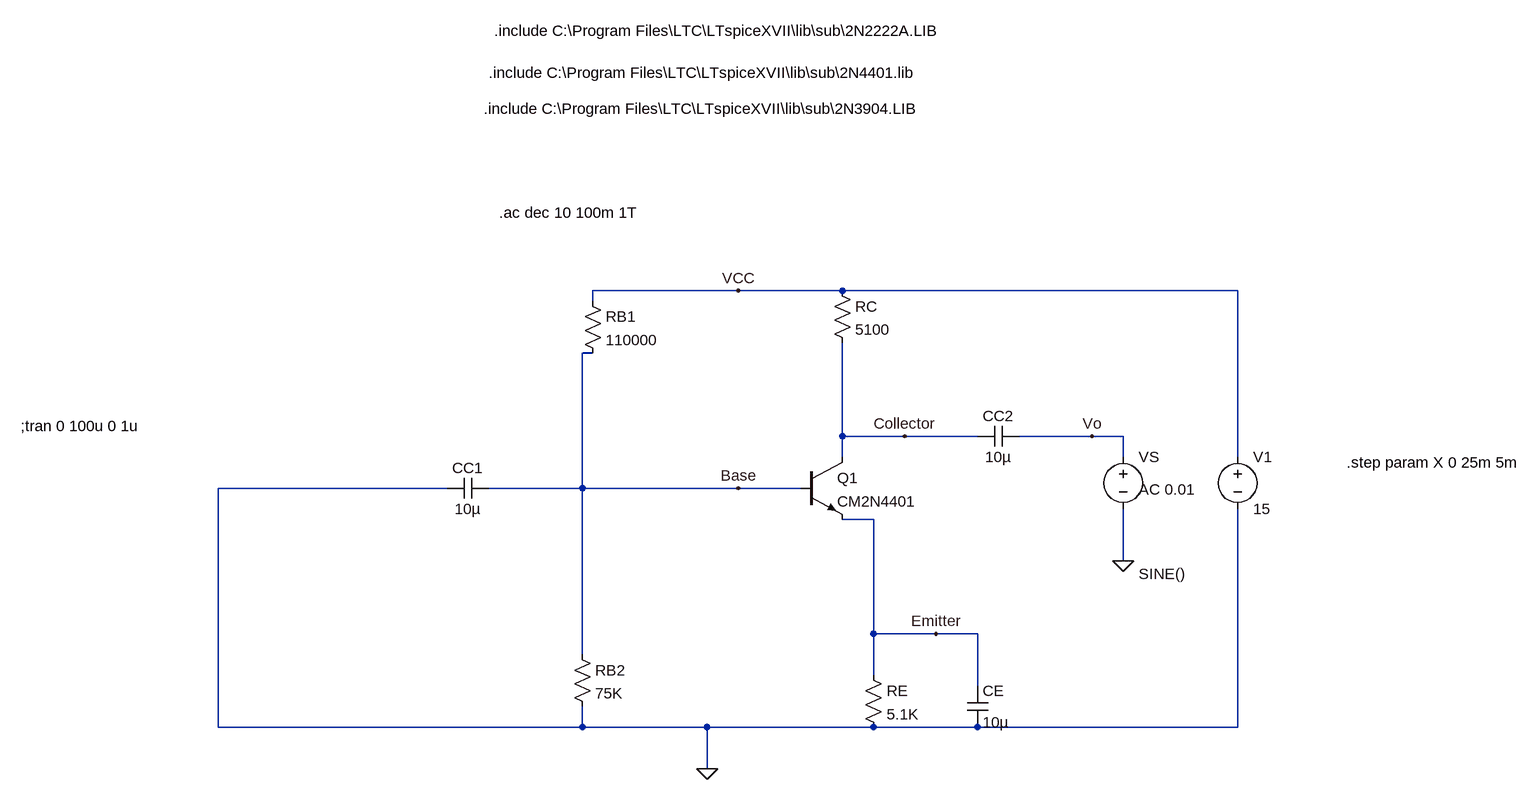
[diagram p0: schematic mp2 task2 d).asc]
mp2 task2 d).asc, the LTspice schematic file:
Version 4
SHEET 1 3216 804
WIRE 288 -16 64 -16
WIRE 448 -16 288 -16
WIRE 1056 -16 448 -16
WIRE 64 0 64 -16
WIRE 64 80 48 80
WIRE 448 208 448 64
WIRE 544 208 448 208
WIRE 656 208 544 208
WIRE 832 208 720 208
WIRE 880 208 832 208
WIRE 448 240 448 208
WIRE 880 240 880 208
WIRE 1056 240 1056 -16
WIRE -160 288 -512 288
WIRE 48 288 48 80
WIRE 48 288 -96 288
WIRE 288 288 48 288
WIRE 384 288 288 288
WIRE 496 336 448 336
WIRE 880 400 880 320
WIRE 496 512 496 336
WIRE 592 512 496 512
WIRE 656 512 592 512
WIRE 48 544 48 288
WIRE 496 576 496 512
WIRE 656 592 656 512
WIRE -512 656 -512 288
WIRE 48 656 48 624
WIRE 48 656 -512 656
WIRE 240 656 48 656
WIRE 496 656 240 656
WIRE 656 656 496 656
WIRE 1056 656 1056 320
WIRE 1056 656 656 656
WIRE 240 720 240 656
FLAG 240 720 0
FLAG 288 -16 VCC
FLAG 592 512 Emitter
FLAG 880 400 0
FLAG 544 208 Collector
FLAG 288 288 Base
FLAG 832 208 Vo
SYMBOL res 48 -16 R0
SYMATTR InstName RB1
SYMATTR Value 110000
SYMBOL res 432 -32 R0
SYMATTR InstName RC
SYMATTR Value 5100
SYMBOL res 32 528 R0
SYMATTR InstName RB2
SYMATTR Value 75K
SYMBOL npn 384 240 R0
SYMATTR InstName Q1
SYMATTR Value CM2N4401
SYMBOL res 480 560 R0
SYMATTR InstName RE
SYMATTR Value 5.1K
SYMBOL cap -96 272 R90
WINDOW 0 0 32 VBottom 2
WINDOW 3 32 32 VTop 2
SYMATTR InstName CC1
SYMATTR Value 10µ
SYMBOL cap 640 592 R0
SYMATTR InstName CE
SYMATTR Value 10µ
SYMBOL cap 720 192 R90
WINDOW 0 0 32 VBottom 2
WINDOW 3 32 32 VTop 2
SYMATTR InstName CC2
SYMATTR Value 10µ
SYMBOL voltage 880 224 R0
WINDOW 3 24 196 Left 2
WINDOW 123 24 66 Left 2
WINDOW 39 0 0 Left 0
SYMATTR Value SINE()
SYMATTR Value2 AC 0.01
SYMATTR InstName VS
SYMBOL voltage 1056 224 R0
WINDOW 123 0 0 Left 0
WINDOW 39 0 0 Left 0
SYMATTR InstName V1
SYMATTR Value 15
TEXT -104 -296 Left 2 !.include C:\\Program Files\\LTC\\LTspiceXVII\\lib\\sub\\2N3904.LIB
TEXT -96 -352 Left 2 !.include C:\\Program Files\\LTC\\LTspiceXVII\\lib\\sub\\2N4401.lib
TEXT -88 -416 Left 2 !.include C:\\Program Files\\LTC\\LTspiceXVII\\lib\\sub\\2N2222A.LIB
TEXT -80 -136 Left 2 !.ac dec 10 100m 1T
TEXT -816 192 Left 2 !;tran 0 100u 0 1u
TEXT 1224 248 Left 2 !.step param X 0 25m 5m

The netlist it stands for:
* mp2 task2 d).asc
RB1 VCC Base 110000
RC VCC Collector 5100
RB2 Base 0 75K
Q1 Collector Base Emitter 0 CM2N4401
RE Emitter 0 5.1K
CC1 Base 0 10µ
CE Emitter 0 10µ
CC2 Vo Collector 10µ
VS Vo 0 SINE() AC 0.01
V1 VCC 0 15
.model NPN NPN
.model PNP PNP
.lib standard.bjt
.include C:\Program Files\LTC\LTspiceXVII\lib\sub\2N3904.LIB
.include C:\Program Files\LTC\LTspiceXVII\lib\sub\2N4401.lib
.include C:\Program Files\LTC\LTspiceXVII\lib\sub\2N2222A.LIB
.ac dec 10 100m 1T
;tran 0 100u 0 1u
.step param X 0 25m 5m
.backanno
.end

* Results of the author's LTspice run, read from the files saved beside the schematic
* Operating Point (first step), zero values left out:
*   V(vcc) = 15 V
*   V(base) = 5.778 V
*   V(collector) = 9.915 V
*   V(emitter) = 5.12 V
*   Ic(Q1) = 997.1 µA
*   Ib(Q1) = 6.803 µA
*   Ie(Q1) = -1.004 mA
*   I(Re) = 1.004 mA
*   I(Rb2) = 77.04 µA
*   I(Rc) = 997.1 µA
*   I(Rb1) = 83.84 µA
*   I(V1) = -1.081 mA
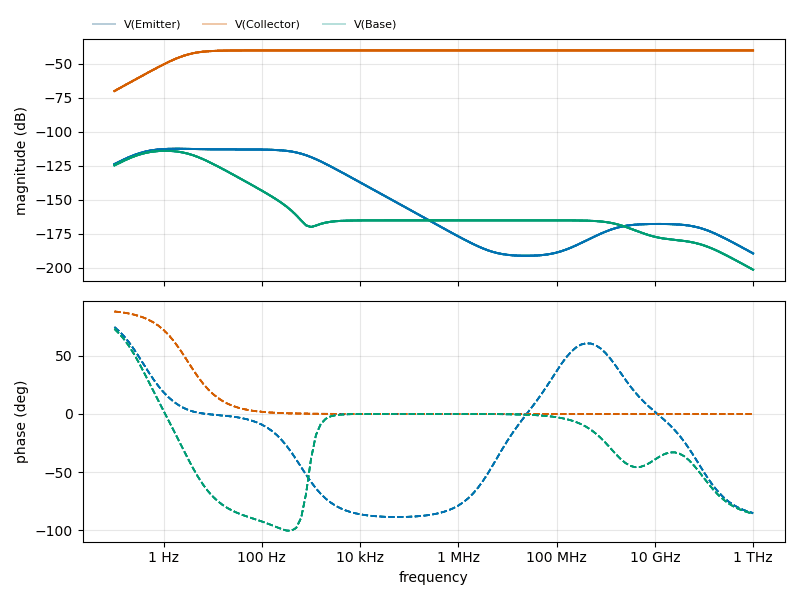
[diagram p1: AC Analysis of mp2 task2 d).asc, plotted from the saved traces]
* AC Analysis, 6 runs:
*   V(Emitter) [x=0]: -123.78 dB at 100 mHz, -189.58 dB at 1 THz, peak -112.46 dB at 1.995 Hz, 3 dB below the peak at 344.1 mHz and 538.7 Hz
*   V(Emitter) [x=0.005]: -123.78 dB at 100 mHz, -189.58 dB at 1 THz, peak -112.46 dB at 1.995 Hz, 3 dB below the peak at 344.1 mHz and 538.7 Hz
*   V(Emitter) [x=0.01]: -123.78 dB at 100 mHz, -189.58 dB at 1 THz, peak -112.46 dB at 1.995 Hz, 3 dB below the peak at 344.1 mHz and 538.7 Hz
*   V(Emitter) [x=0.015]: -123.78 dB at 100 mHz, -189.58 dB at 1 THz, peak -112.46 dB at 1.995 Hz, 3 dB below the peak at 344.1 mHz and 538.7 Hz
*   V(Emitter) [x=0.02]: -123.78 dB at 100 mHz, -189.58 dB at 1 THz, peak -112.46 dB at 1.995 Hz, 3 dB below the peak at 344.1 mHz and 538.7 Hz
*   V(Emitter) [x=0.025]: -123.78 dB at 100 mHz, -189.58 dB at 1 THz, peak -112.46 dB at 1.995 Hz, 3 dB below the peak at 344.1 mHz and 538.7 Hz
*   V(Collector) [x=0]: -69.91 dB at 100 mHz, -40.00 dB at 1 THz, peak -40.00 dB at 1 THz, 3 dB below the peak at 3.127 Hz
*   V(Collector) [x=0.005]: -69.91 dB at 100 mHz, -40.00 dB at 1 THz, peak -40.00 dB at 1 THz, 3 dB below the peak at 3.127 Hz
*   V(Collector) [x=0.01]: -69.91 dB at 100 mHz, -40.00 dB at 1 THz, peak -40.00 dB at 1 THz, 3 dB below the peak at 3.127 Hz
*   V(Collector) [x=0.015]: -69.91 dB at 100 mHz, -40.00 dB at 1 THz, peak -40.00 dB at 1 THz, 3 dB below the peak at 3.127 Hz
*   V(Collector) [x=0.02]: -69.91 dB at 100 mHz, -40.00 dB at 1 THz, peak -40.00 dB at 1 THz, 3 dB below the peak at 3.127 Hz
*   V(Collector) [x=0.025]: -69.91 dB at 100 mHz, -40.00 dB at 1 THz, peak -40.00 dB at 1 THz, 3 dB below the peak at 3.127 Hz
*   V(Base) [x=0]: -124.73 dB at 100 mHz, -201.58 dB at 1 THz, peak -114.00 dB at 1 Hz, 3 dB below the peak at 306 mHz and 3.791 Hz
*   V(Base) [x=0.005]: -124.73 dB at 100 mHz, -201.58 dB at 1 THz, peak -114.00 dB at 1 Hz, 3 dB below the peak at 306 mHz and 3.791 Hz
*   V(Base) [x=0.01]: -124.73 dB at 100 mHz, -201.58 dB at 1 THz, peak -114.00 dB at 1 Hz, 3 dB below the peak at 306 mHz and 3.791 Hz
*   V(Base) [x=0.015]: -124.73 dB at 100 mHz, -201.58 dB at 1 THz, peak -114.00 dB at 1 Hz, 3 dB below the peak at 306 mHz and 3.791 Hz
*   V(Base) [x=0.02]: -124.73 dB at 100 mHz, -201.58 dB at 1 THz, peak -114.00 dB at 1 Hz, 3 dB below the peak at 306 mHz and 3.791 Hz
*   V(Base) [x=0.025]: -124.73 dB at 100 mHz, -201.58 dB at 1 THz, peak -114.00 dB at 1 Hz, 3 dB below the peak at 306 mHz and 3.791 Hz